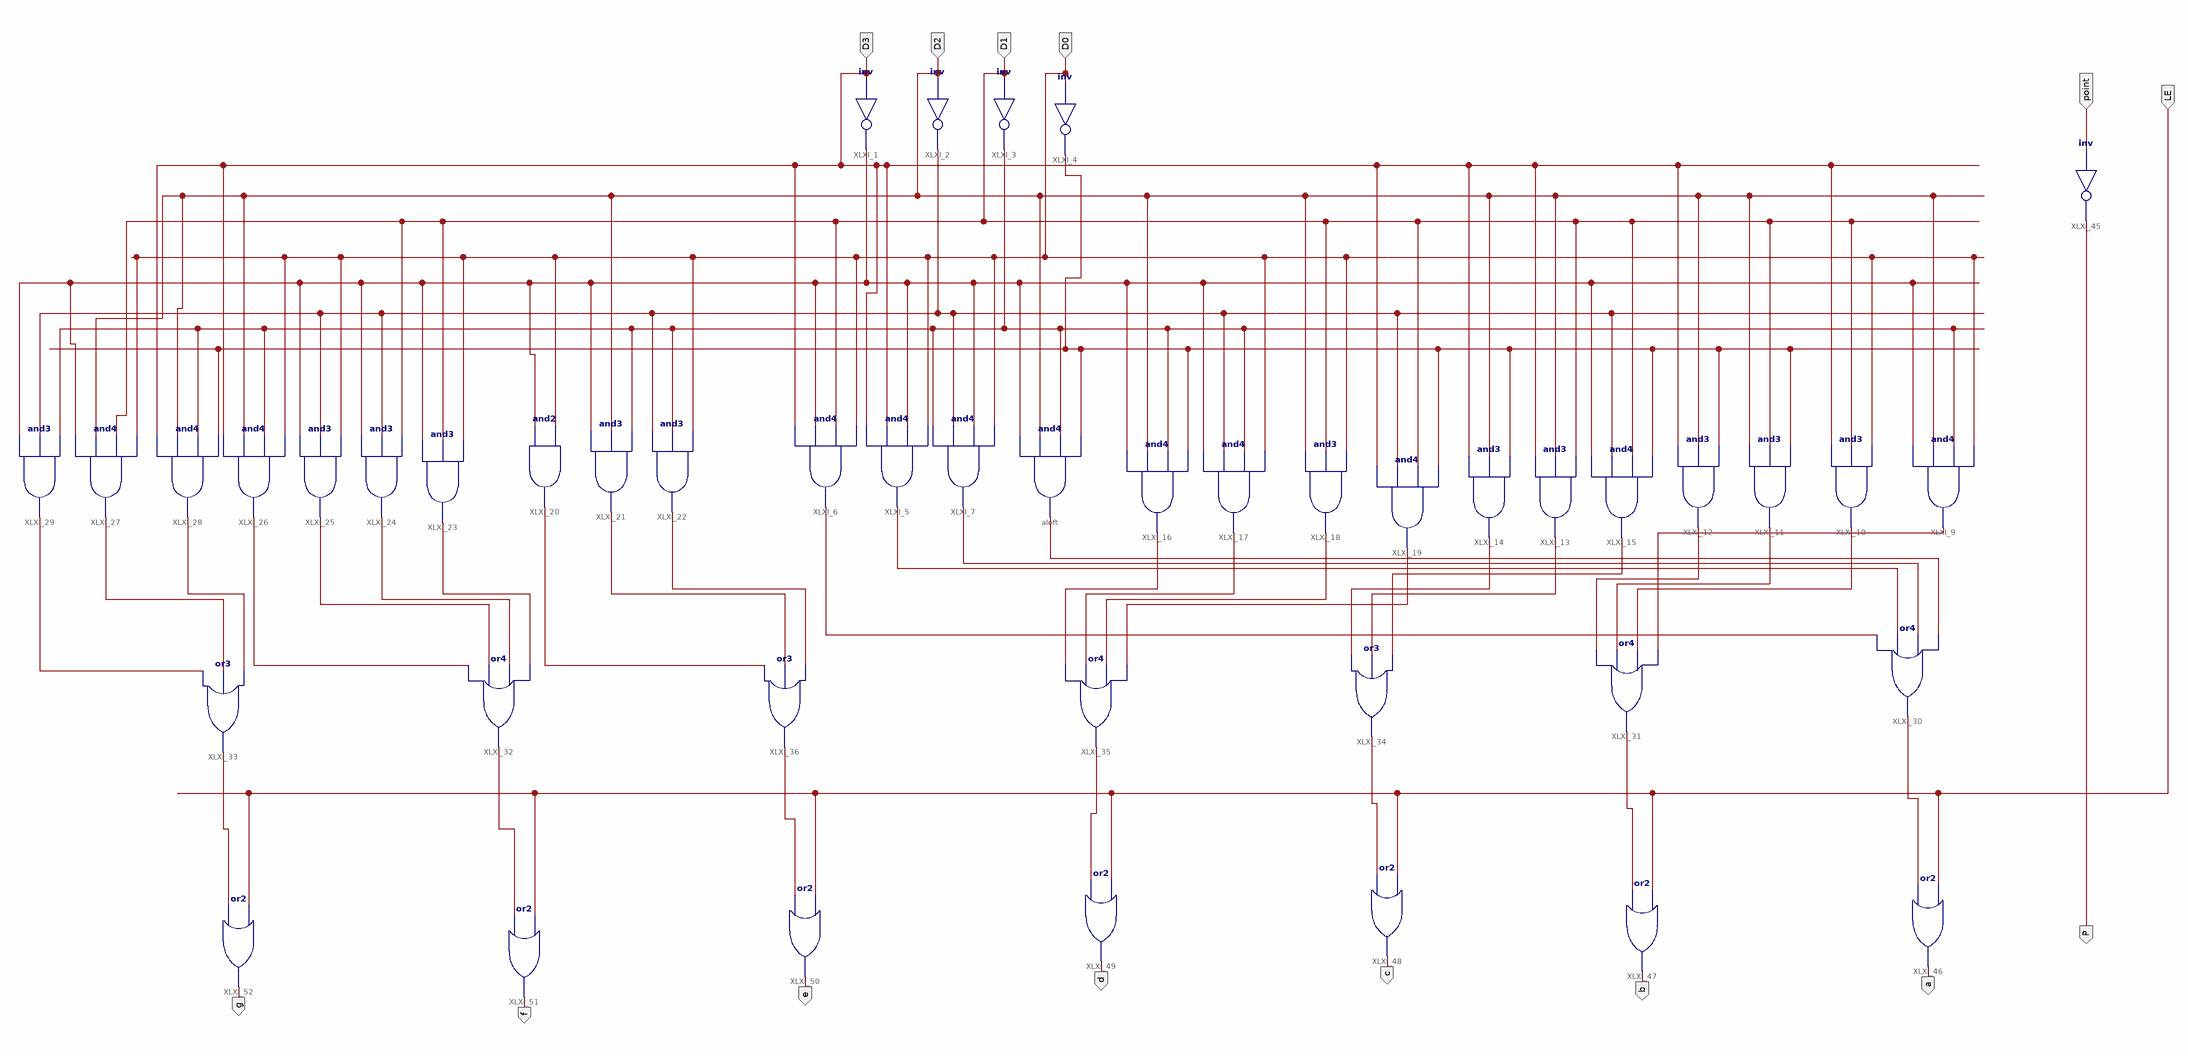
[diagram p0: schematic sheet 1]
// Xilinx ISE schematic MyMC14495.sch (artix7) as structural Verilog: 44 symbols, 14 ports
module MyMC14495 (
  input  D3,
  input  D2,
  input  D0,
  input  D1,
  input  point,
  input  LE,
  output P,
  output a,
  output b,
  output c,
  output d,
  output e,
  output f,
  output g
);

  wire XLXN_12, XLXN_13, XLXN_14, XLXN_15, XLXN_16, XLXN_17, XLXN_18, XLXN_19, XLXN_20, XLXN_21, XLXN_22,
       XLXN_23, XLXN_24, XLXN_25, XLXN_26, XLXN_58, XLXN_59, XLXN_60, XLXN_61, XLXN_62, XLXN_64, XLXN_65,
       XLXN_66, XLXN_67, XLXN_68, XLXN_69, XLXN_70, XLXN_71, XLXN_72, XLXN_76, XLXN_77, XLXN_78, XLXN_79,
       XLXN_80, XLXN_81, XLXN_82;

  not XLXI_1 (XLXN_15, D3);
  not XLXI_2 (XLXN_13, D2);
  not XLXI_3 (XLXN_14, D1);
  not XLXI_4 (XLXN_12, D0);
  and XLXI_5 (XLXN_17, D3, D3, XLXN_15, D0);
  and XLXI_6 (XLXN_16, D3, XLXN_15, D1, D0);
  and XLXI_7 (XLXN_18, XLXN_14, XLXN_13, XLXN_15, D0);
  and aleft (XLXN_19, XLXN_15, D2, XLXN_14, XLXN_12);
  and XLXI_9 (XLXN_20, XLXN_15, D2, XLXN_14, D0);
  and XLXI_10 (XLXN_21, D3, D1, D0);
  and XLXI_11 (XLXN_22, D2, D1, XLXN_12);
  and XLXI_12 (XLXN_23, D3, D2, XLXN_12);
  and XLXI_13 (XLXN_25, D3, D2, D1);
  and XLXI_14 (XLXN_26, D3, D2, XLXN_12);
  and XLXI_15 (XLXN_24, XLXN_15, XLXN_13, D1, XLXN_12);
  and XLXI_16 (XLXN_61, XLXN_15, D2, XLXN_14, XLXN_12);
  and XLXI_17 (XLXN_60, XLXN_15, XLXN_13, XLXN_14, D0);
  and XLXI_18 (XLXN_59, D2, D1, D0);
  and XLXI_19 (XLXN_58, D3, XLXN_13, D1, XLXN_12);
  and XLXI_20 (XLXN_65, XLXN_15, D0);
  and XLXI_21 (XLXN_64, XLXN_15, D2, XLXN_14);
  and XLXI_22 (XLXN_62, XLXN_13, XLXN_14, D0);
  and XLXI_23 (XLXN_66, XLXN_15, D1, D0);
  and XLXI_24 (XLXN_67, XLXN_15, XLXN_13, D1);
  and XLXI_25 (XLXN_68, XLXN_15, XLXN_13, D0);
  and XLXI_26 (XLXN_69, D3, D2, XLXN_14, D0);
  and XLXI_27 (XLXN_71, XLXN_15, D2, D1, D0);
  and XLXI_28 (XLXN_70, D3, D2, XLXN_14, XLXN_12);
  and XLXI_29 (XLXN_72, XLXN_15, XLXN_13, XLXN_14);
  or XLXI_30 (XLXN_82, XLXN_16, XLXN_17, XLXN_18, XLXN_19);
  or XLXI_31 (XLXN_81, XLXN_23, XLXN_22, XLXN_21, XLXN_20);
  or XLXI_32 (XLXN_77, XLXN_69, XLXN_68, XLXN_67, XLXN_66);
  or XLXI_33 (XLXN_76, XLXN_72, XLXN_71, XLXN_70);
  or XLXI_34 (XLXN_80, XLXN_26, XLXN_25, XLXN_24);
  or XLXI_35 (XLXN_79, XLXN_61, XLXN_60, XLXN_59, XLXN_58);
  or XLXI_36 (XLXN_78, XLXN_65, XLXN_64, XLXN_62);
  not XLXI_45 (P, point);
  or XLXI_46 (a, XLXN_82, LE);
  or XLXI_47 (b, XLXN_81, LE);
  or XLXI_48 (c, XLXN_80, LE);
  or XLXI_49 (d, XLXN_79, LE);
  or XLXI_50 (e, XLXN_78, LE);
  or XLXI_51 (f, XLXN_77, LE);
  or XLXI_52 (g, XLXN_76, LE);
endmodule
